# Altium schematic sheet Two_finger.SchDoc
size A4; SheetNumber: 1; SheetTotal: 1
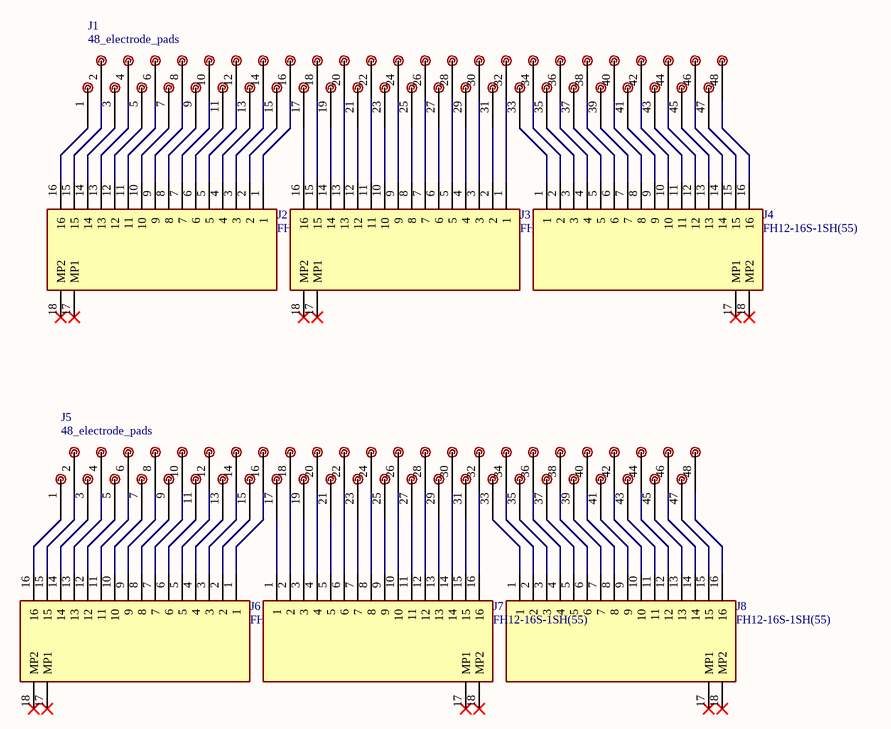
[diagram p0: Two_finger.SchDoc]

## Parts
J1  48_electrode_pads  [48_ELECTRODE_PADS]
J2  FH12-16S-1SH(55)  [FH12-16S-1SH(55)]
J3  FH12-16S-1SH(55)  [FH12-16S-1SH(55)]
J4  FH12-16S-1SH(55)  [FH12-16S-1SH(55)]
J5  48_electrode_pads  [48_ELECTRODE_PADS]
J6  FH12-16S-1SH(55)  [FH12-16S-1SH(55)]
J7  FH12-16S-1SH(55)  [FH12-16S-1SH(55)]
J8  FH12-16S-1SH(55)  [FH12-16S-1SH(55)]

## Nets
NetJ1_1: J1.1 J2.16
NetJ1_2: J1.2 J2.15
NetJ1_3: J1.3 J2.14
NetJ1_4: J1.4 J2.13
NetJ1_5: J1.5 J2.12
NetJ1_6: J1.6 J2.11
NetJ1_7: J1.7 J2.10
NetJ1_8: J1.8 J2.9
NetJ1_9: J1.9 J2.8
NetJ1_10: J1.10 J2.7
NetJ1_11: J1.11 J2.6
NetJ1_12: J1.12 J2.5
NetJ1_13: J1.13 J2.4
NetJ1_14: J1.14 J2.3
NetJ1_15: J1.15 J2.2
NetJ1_16: J1.16 J2.1
NetJ1_17: J1.17 J3.16
NetJ1_18: J1.18 J3.15
NetJ1_19: J1.19 J3.14
NetJ1_20: J1.20 J3.13
NetJ1_21: J1.21 J3.12
NetJ1_22: J1.22 J3.11
NetJ1_23: J1.23 J3.10
NetJ1_24: J1.24 J3.9
NetJ1_25: J1.25 J3.8
NetJ1_26: J1.26 J3.7
NetJ1_27: J1.27 J3.6
NetJ1_28: J1.28 J3.5
NetJ1_29: J1.29 J3.4
NetJ1_30: J1.30 J3.3
NetJ1_31: J1.31 J3.2
NetJ1_32: J1.32 J3.1
NetJ1_33: J1.33 J4.1
NetJ1_34: J1.34 J4.2
NetJ1_35: J1.35 J4.3
NetJ1_36: J1.36 J4.4
NetJ1_37: J1.37 J4.5
NetJ1_38: J1.38 J4.6
NetJ1_39: J1.39 J4.7
NetJ1_40: J1.40 J4.8
NetJ1_41: J1.41 J4.9
NetJ1_42: J1.42 J4.10
NetJ1_43: J1.43 J4.11
NetJ1_44: J1.44 J4.12
NetJ1_45: J1.45 J4.13
NetJ1_46: J1.46 J4.14
NetJ1_47: J1.47 J4.15
NetJ1_48: J1.48 J4.16
NetJ5_1: J5.1 J6.16
NetJ5_2: J5.2 J6.15
NetJ5_3: J5.3 J6.14
NetJ5_4: J5.4 J6.13
NetJ5_5: J5.5 J6.12
NetJ5_6: J5.6 J6.11
NetJ5_7: J5.7 J6.10
NetJ5_8: J5.8 J6.9
NetJ5_9: J5.9 J6.8
NetJ5_10: J5.10 J6.7
NetJ5_11: J5.11 J6.6
NetJ5_12: J5.12 J6.5
NetJ5_13: J5.13 J6.4
NetJ5_14: J5.14 J6.3
NetJ5_15: J5.15 J6.2
NetJ5_16: J5.16 J6.1
NetJ5_17: J5.17 J7.1
NetJ5_18: J5.18 J7.2
NetJ5_19: J5.19 J7.3
NetJ5_20: J5.20 J7.4
NetJ5_21: J5.21 J7.5
NetJ5_22: J5.22 J7.6
NetJ5_23: J5.23 J7.7
NetJ5_24: J5.24 J7.8
NetJ5_25: J5.25 J7.9
NetJ5_26: J5.26 J7.10
NetJ5_27: J5.27 J7.11
NetJ5_28: J5.28 J7.12
NetJ5_29: J5.29 J7.13
NetJ5_30: J5.30 J7.14
NetJ5_31: J5.31 J7.15
NetJ5_32: J5.32 J7.16
NetJ5_33: J5.33 J8.1
NetJ5_34: J5.34 J8.2
NetJ5_35: J5.35 J8.3
NetJ5_36: J5.36 J8.4
NetJ5_37: J5.37 J8.5
NetJ5_38: J5.38 J8.6
NetJ5_39: J5.39 J8.7
NetJ5_40: J5.40 J8.8
NetJ5_41: J5.41 J8.9
NetJ5_42: J5.42 J8.10
NetJ5_43: J5.43 J8.11
NetJ5_44: J5.44 J8.12
NetJ5_45: J5.45 J8.13
NetJ5_46: J5.46 J8.14
NetJ5_47: J5.47 J8.15
NetJ5_48: J5.48 J8.16

Not connected (* = marked no-connect by the designer): J2 17(MP1)* 18(MP2)*; J3 17(MP1)* 18(MP2)*; J4 17(MP1)* 18(MP2)*; J6 17(MP1)* 18(MP2)*; J7 17(MP1)* 18(MP2)*; J8 17(MP1)* 18(MP2)*